# EAGLE design WavePainter_1.1 (EAGLE 9.5.1)
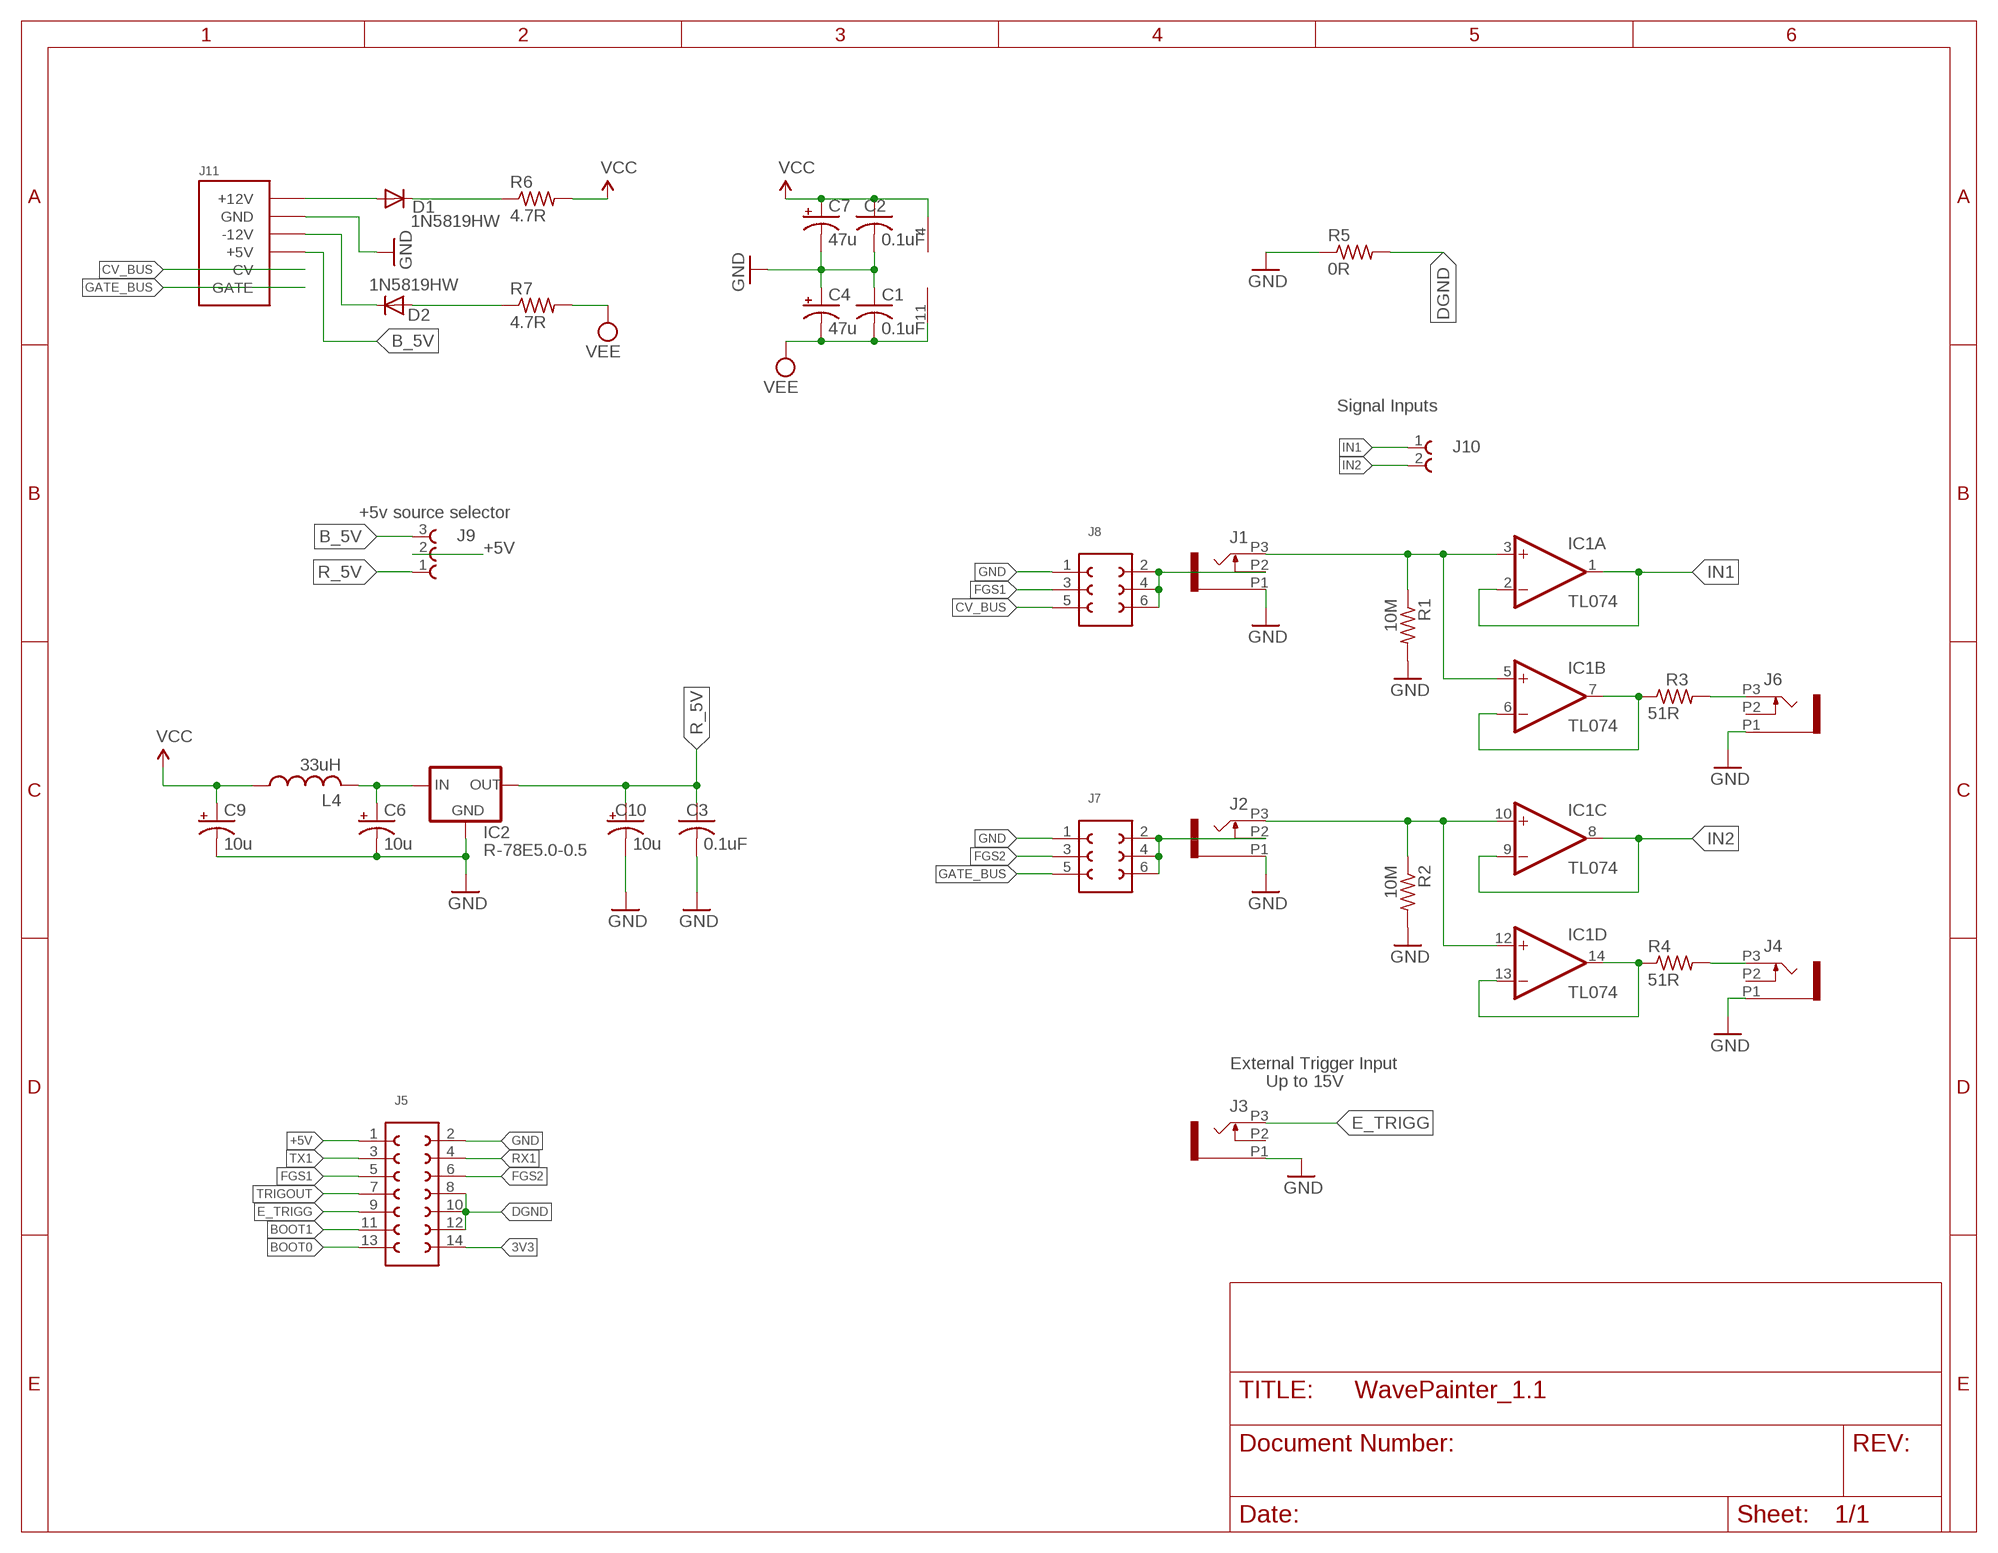
[diagram p0: schematic, sheet 1]

## Parts
C1  0.1uF  C-USC0805  [C0805]
C2  0.1uF  C-USC0805  [C0805]
C3  0.1uF  C-USC0805  [C0805]
C4  47u  CPOL-USD  [PANASONIC_D]
C6  10u  CPOL-USB  [PANASONIC_B]
C7  47u  CPOL-USD  [PANASONIC_D]
C9  10u  CPOL-USB  [PANASONIC_B]
C10  10u  CPOL-USB  [PANASONIC_B]
D1  1N5819HW  DIODE_DIODE-SOD123  [DIODE_SOD123]
D2  1N5819HW  DIODE_DIODE-SOD123  [DIODE_SOD123]
IC1  TL074  TL074D  [SO14]
IC2  R-78E5.0-0.5  [SIP3]
J1  OG-PJ301_PJ301_THONKICONN7  [OG-PJ301_WQP_PJ_301M7]
J2  OG-PJ301_PJ301_THONKICONN7  [OG-PJ301_WQP_PJ_301M7]
J3  OG-PJ301_PJ301_THONKICONN7  [OG-PJ301_WQP_PJ_301M7]
J4  OG-PJ301_PJ301_THONKICONN7  [OG-PJ301_WQP_PJ_301M7]
J5  62001421821  [62001421821]
J6  OG-PJ301_PJ301_THONKICONN7  [OG-PJ301_WQP_PJ_301M7]
J7  61300621121  [61300621121]
J8  61300621121  [61300621121]
J9  61300311121  [61300311121]
J10  61300211821  [61300211821]
J11  POWER_SHROUDED_NOTEXT  [POWER_16_SHROUDED_NOTEXT]
L4  33uH  L-USL3225P  [L3225P]
R1  10M  R-US_R0805  [R0805]
R2  10M  R-US_R0805  [R0805]
R3  51R  R-US_R0805  [R0805]
R4  51R  R-US_R0805  [R0805]
R5  0R  R-US_R0805  [R0805]
R6  4.7R  R-US_R1206  [R1206]
R7  4.7R  R-US_R1206  [R1206]

## Nets
3V3: J5.14
+5V: J5.1 J9.2
B_5V: J9.3 J11.11(+5V) J11.12(+5V)
BOOT0: J5.13
BOOT1: J5.11
CV_BUS: J8.5 J11.13(CV) J11.14(CV)
DGND: J5.8 J5.10 J5.12 R5.2
E_TRIGG: J3.P3 J5.9
FGS1: J5.5 J8.3
FGS2: J5.6 J7.3
GATE_BUS: J7.5 J11.15(GATE) J11.16(GATE)
GND: C1.1 C2.2 C3.2 C4.+ C6.- C7.- C9.- C10.- IC2.2(GND) J1.P1 J2.P1 J3.P1 J4.P1 J5.2 J6.P1 J7.1 J8.1 J11.3(GND) J11.4(GND) J11.5(GND) J11.6(GND) J11.7(GND) J11.8(GND) R1.2 R2.2 R5.1
IN1: IC1.1(A:OUT) IC1.2(A:-IN) J10.1
IN2: IC1.8(C:OUT) IC1.9(C:-IN) J10.2
N$1: IC1.10(C:+IN) IC1.12(D:+IN) J2.P3 R2.1
N$2: D2.C J11.1(-12V) J11.2(-12V)
N$3: C6.+ IC2.1(IN) L4.2
N$4: D1.A J11.9(+12V) J11.10(+12V)
N$5: IC1.3(A:+IN) IC1.5(B:+IN) J1.P3 R1.1
N$7: J4.P3 R4.2
N$8: D1.C R6.1
N$9: D2.A R7.1
N$10: J6.P3 R3.2
N$11: IC1.6(B:-IN) IC1.7(B:OUT) R3.1
N$12: IC1.13(D:-IN) IC1.14(D:OUT) R4.1
N$13: J1.P2 J8.2 J8.4 J8.6
N$14: J2.P2 J7.2 J7.4 J7.6
R_5V: C3.1 C10.+ IC2.3(OUT) J9.1
RX1: J5.4
TRIGOUT: J5.7
TX1: J5.3
VCC: C2.1 C7.+ C9.+ IC1.4(P:V+) L4.1 R6.2
VEE: C1.2 C4.- IC1.11(P:V-) R7.2
Unconnected: J3.P2 J4.P2 J6.P2

## Notes on the sheet
- Signal Inputs
- +5v source selector
- External Trigger Input
- Up to 15V

## Library data of the parts
C1-C3 = rcl:C-US: CAPACITOR, American symbol; SPICEPREFIX: C
C4 C7 = rcl:CPOL-US: POLARIZED CAPACITOR, American symbol
C6 C9 C10 = rcl:CPOL-US: POLARIZED CAPACITOR, American symbol; SPICEPREFIX: C
D1 D2 = elements_v02:DIODE_DIODE-: DIODE
IC1 = linear:TL074: OP AMP
IC2 = r-78xx_10:R-78E*-0.5: Innoline R-78xx-0.5 Series Switching Regulators - 0.5A, Low Cost Source: http://www.recom-international.com/pdf/Innoline/R-78Exx-0.5.pdf; MF: Recom; MPN: R-785.0-0.5; OC_FARNELL: 2078564; OC_NEWARK: 62X9499
J1-J4 J6 = elements_v02:OG-PJ301_PJ301_THONKICONN
J5 = Wurth_Elektronik_Electromechanic_Board_to_Board_Connectors_rev18b:62001421821: WR-PHD 2.00mm Dual Socket Header, 14 Pins=>Code : Con_BTB_SHD_2.00_2_62001421821 <http://katalog.we-online.de/media/thumbs2/eican/thb_Con_BTB_SHD_2.00_2_6200xx21821_pf2.jpg> Details see: http://katalog.we-online.de/en/em/PHD_2_00_DUAL_SOCKET_HEADER_6200XX21821 Created 2014-06-03, Karrer Zheng 2014 (C) Würth Elektronik
J7 J8 = Wurth_Elektronik_Electromechanic_Board_to_Board_Connectors_rev18b:61300621121: WR-PHD 2.54mm Dual Pin Header, 6 Pins =>Code : Con_BTB_PHD_2.54_2_61300621121 <http://katalog.we-online.de/media/images/eican/Con_BTB_PHD_2.54_2_6130xx21121_pf2.jpg> Details see: http://katalog.we-online.de/en/em/613_0xx_211_21 Created 2014-05-29, Karrer Zheng 2014 (C) Würth Elektronik
J9 = Wurth_Elektronik_Electromechanic_Board_to_Board_Connectors_rev17a:61300311121: WR-PHD 5.54mm Pin Header, 3 Pin =>Code : Con_BTB_PHD_2.54_1_THT_61300311121 <http://katalog.we-online.de/media/images/eican/Con_BTB_PHD_2.54_1_THT_6130xx11121_pf2.jpg> Details see: http://katalog.we-online.de/en/em/613_0xx_111_21 Created 2014-05-29, Karrer Zheng 2014 (C) Würth Elektronik
J10 = Wurth_Elektronik_Electromechanic_Board_to_Board_Connectors_rev17a:61300211821: WR-PHD 2.54mm Socket Header, 2 Pins =>Code : Con_BTB_SHD_2.54_1_THT_61300211821 <http://katalog.we-online.de/media/images/eican/Con_BTB_SHD_2.54_1_THT_6130xx11821_pf2.jpg> Details see: http://katalog.we-online.de/en/em/613_0xx_118_21 Created 2014-05-29, Karrer Zheng 2014 (C) Würth Elektronik
J11 = EurorackModularParts:POWER
L4 = rcl:L-US: INDUCTOR, American symbol; SPICEPREFIX: L
R1-R7 = rcl:R-US_: RESISTOR, American symbol; SPICEPREFIX: R

## Board
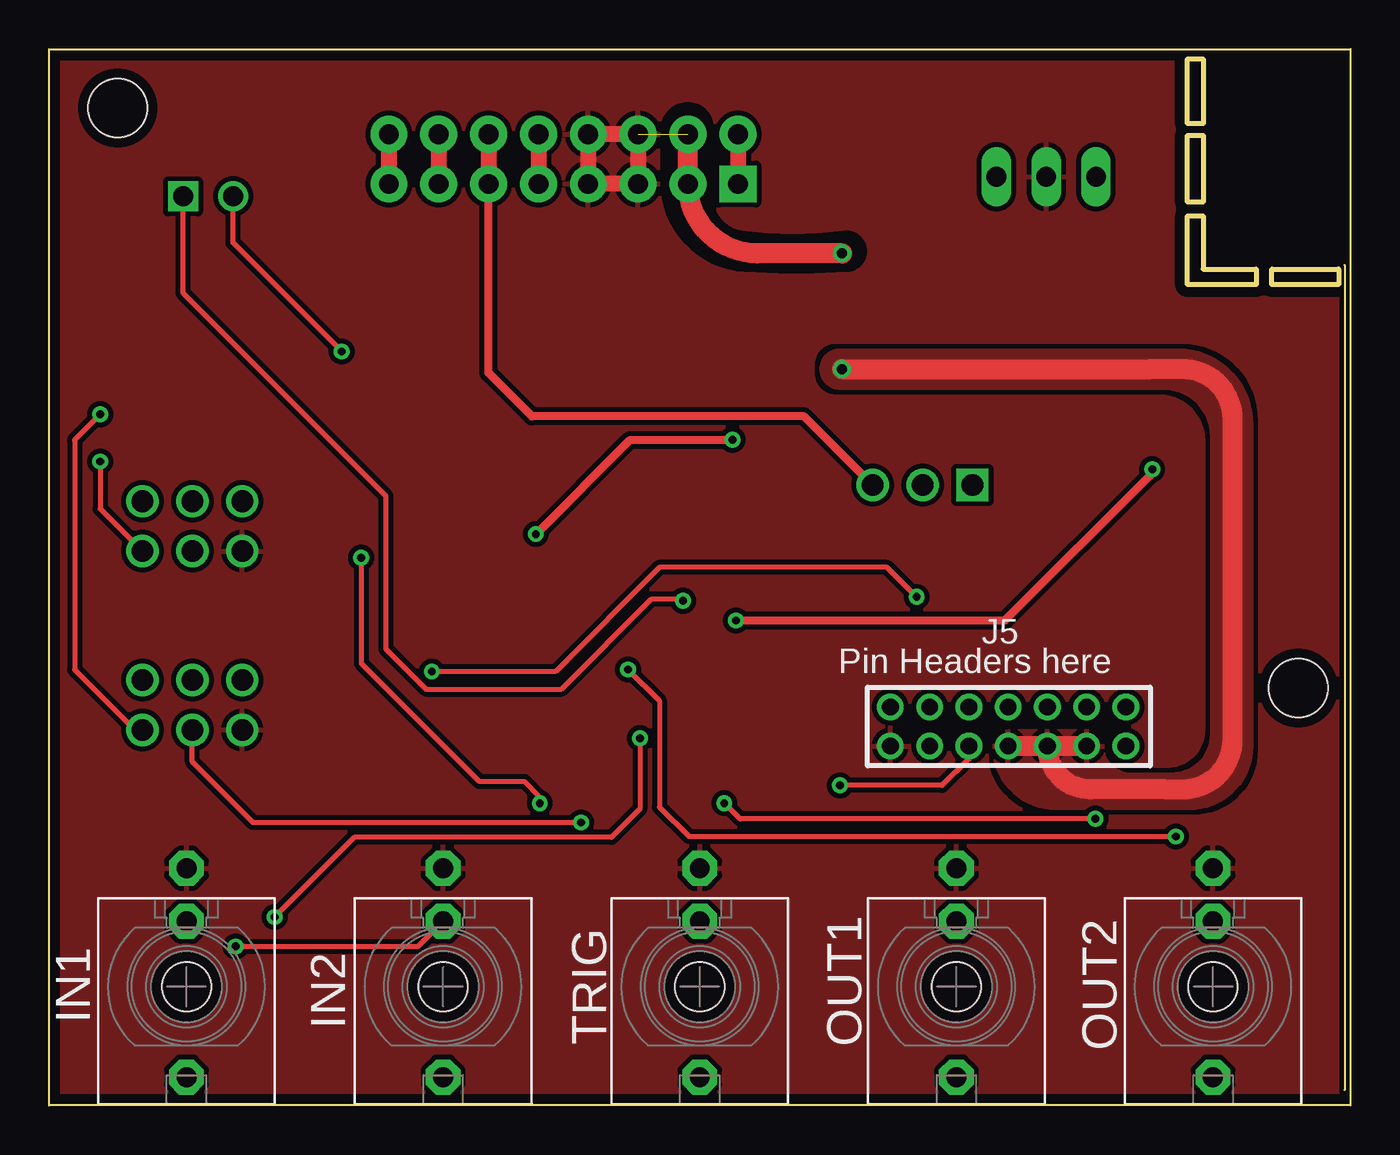
[diagram p1: board, top side]
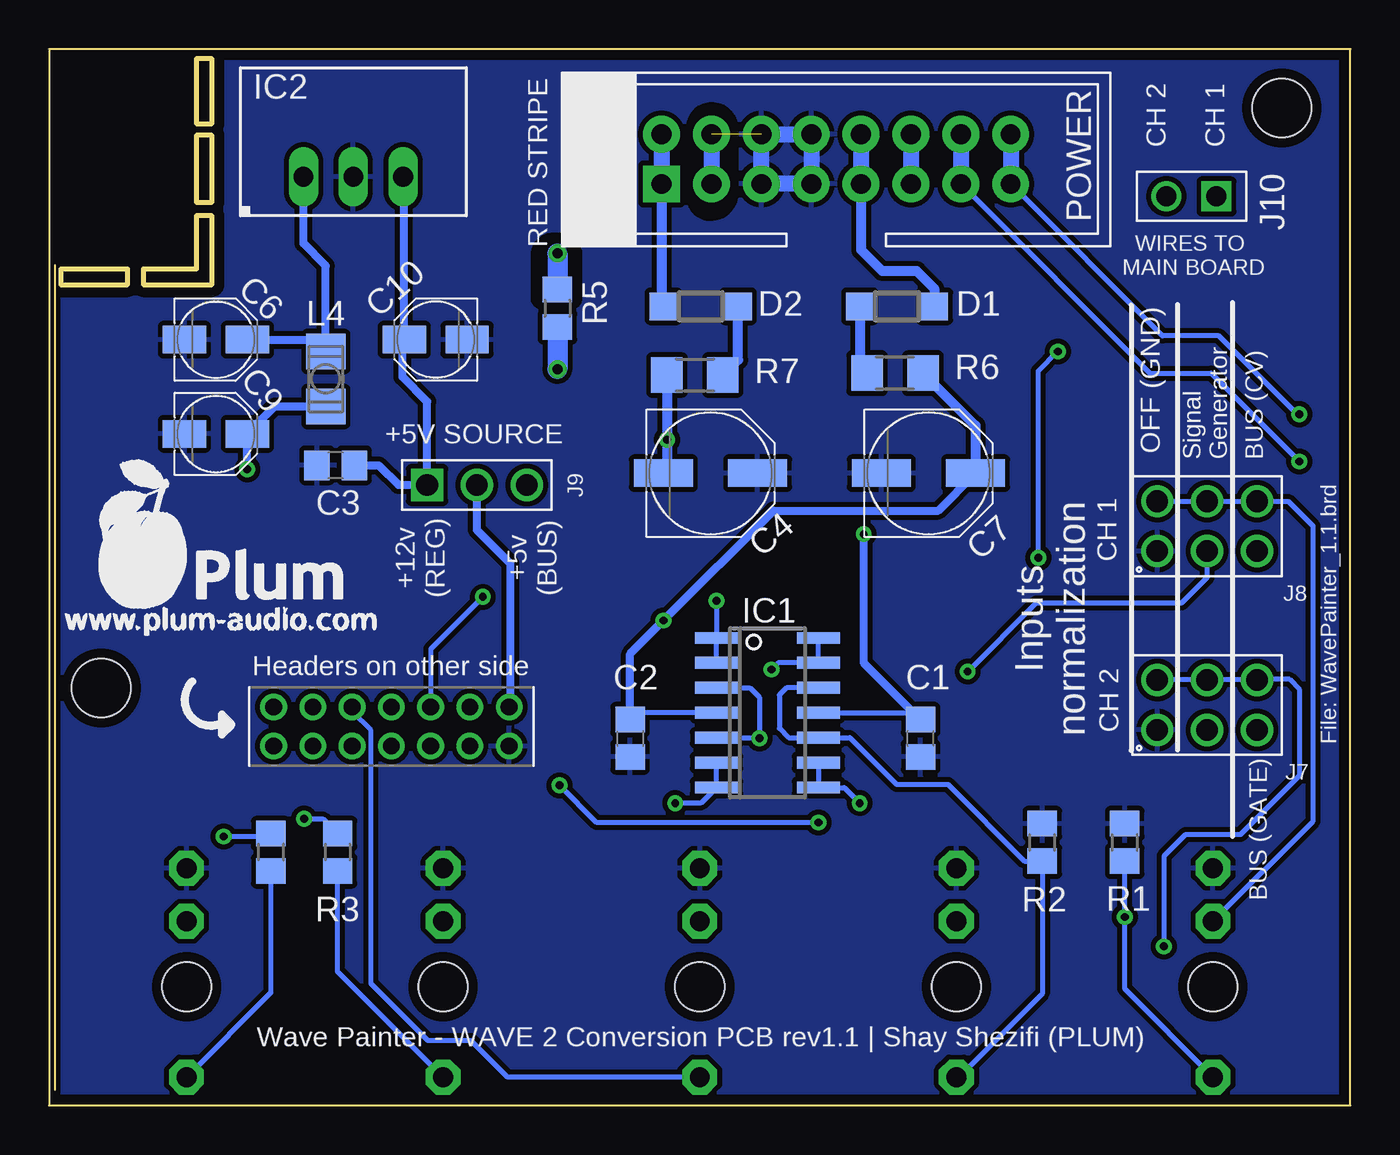
[diagram p2: board, bottom side, seen from below]

Size 66.3 x 53.8 mm. Coordinates in mm from the lower left corner, seen from the top.
Outline: 0,0 0,53.8 66.3,53.8 66.3,0 0,0
Outline: 58.8,53.3 58.8,50 58,50 58,53.3 58.8,53.3
Outline: 58.8,49.4 58.8,46 58,46 58,49.4 58.8,49.4
Outline: 58.8,45.3 58.8,42.6 61.5,42.6 61.5,41.8 58,41.8 58,45.3 58.8,45.3
Outline: 62.3,42.6 65.7,42.6 65.7,41.8 62.3,41.8 62.3,42.6
Copper layers (1*16): Top 0.035mm / dielectric 1.5mm / Bottom 0.035mm
Design rules "default *": minimum track width 10mil, minimum drill 0.4mm, track to track 10mil, track to pad 6mil, pad to pad 6mil, via to via 6mil, smd to smd 6mil, copper to edge 20mil, drill to drill 6mil, minimum pad ring 10mil, minimum via ring 8mil, stop-mask expansion 4mil, vias tented up to drill 25mil, thermal gap 10mil
Holes 3 mm at 3.5,50.8 63.64,21.26
Milling: 1 lines

### Footprints (pad centres in the part's own frame; a part is rotated, then mirrored left to right if it is on the bottom)
C0805 = smd 1.3 x 1.5: 1 -0.95,0; 2 0.95,0
PANASONIC_D = smd 3 x 1.4: + 2.4,0; - -2.4,0
PANASONIC_B = smd 2.2 x 1.4: + 1.6,0; - -1.6,0
DIODE_SOD123 = smd 1.4 x 1.4: A 1.9,0; C -1.9,0
SO14 = smd 0.6 x 2.2: 1 -3.81,-2.6; 2 -2.54,-2.6; 3 -1.27,-2.6; 4 0,-2.6; 5 1.27,-2.6; 6 2.54,-2.6; 7 3.81,-2.6; 8 3.81,2.6; 9 2.54,2.6; 10 1.27,2.6; 11 0,2.6; 12 -1.27,2.6; 13 -2.54,2.6; 14 -3.81,2.6
SIP3 = drill 1 long: 1 -2.54,0; 2 0,0; 3 2.54,0
OG-PJ301_WQP_PJ_301M7 = drill 1.016 pad 1.778 octagon: P1 0,-6.032; P2 0,-3.334; P3 0,4.604 | hole 2.5: 0,0
62001421821 = drill 0.85: 1 -6,-1; 2 -6,1; 3 -4,-1; 4 -4,1; 5 -2,-1; 6 -2,1; 7 0,-1; 8 0,1; 9 2,-1; 10 2,1; 11 4,-1; 12 4,1; 13 6,-1; 14 6,1
61300621121 = drill 1.1: 1 -2.54,-1.27; 2 -2.54,1.27; 3 0,-1.27; 4 0,1.27; 5 2.54,-1.27; 6 2.54,1.27
61300311121 = drill 1.1 square: 1 -2.54,0 | drill 1.1: 2 0,0; 3 2.54,0
61300211821 = drill 1.02 square: 1 -1.27,0 | drill 1.02: 2 1.27,0
POWER_16_SHROUDED_NOTEXT = drill 1.016 pad 1.88 square: 1 -8.89,-1.27 | drill 1.016 pad 1.88: 2 -8.89,1.27; 3 -6.35,-1.27; 4 -6.35,1.27; 5 -3.81,-1.27; 6 -3.81,1.27; 7 -1.27,-1.27; 8 -1.27,1.27; 9 1.27,-1.27; 10 1.27,1.27; 11 3.81,-1.27; 12 3.81,1.27; 13 6.35,-1.27; 14 6.35,1.27; 15 8.89,-1.27; 16 8.89,1.27
L3225P = smd 1.8 x 2: 1 -1.4,0; 2 1.4,0
R0805 = smd 1.3 x 1.5: 1 -0.95,0; 2 0.95,0
R1206 = smd 1.6 x 1.803: 1 -1.422,0; 2 1.422,0

### Placement (x,y rotation side)
C1  21.9,18.7 90 bottom
C2  36.7,18.7 270 bottom
C3  51.7,32.6 180 bottom
C4  32.6,32.2 0 bottom
C6  57.8,39 0 bottom
C7  21.5,32.2 0 bottom
C9  57.8,34.2 0 bottom
C10  46.6,39 180 bottom
D1  23.1,40.7 0 bottom
D2  33.1,40.7 0 bottom
IC1  29.7,20 270 bottom
IC2  50.8,47.3 0 bottom
J1  7,6.05 180 top
J2  20.07,6.05 180 top
J3  33.15,6.05 180 top
J4  59.3,6.05 180 top
J5  48.86,19.3 180 bottom
J6  46.23,6.05 180 top
J7  7.3,20.4 0 bottom
J8  7.3,29.5 0 bottom
J9  44.5,31.6 0 bottom
J10  8.1,46.3 180 bottom
J11  26.2,48.2 0 bottom
L4  52.2,37 90 bottom
R1  11.5,13.4 90 bottom
R2  15.7,13.4 90 bottom
R3  51.6,12.9 270 bottom
R4  55,12.9 270 bottom
R5  40.4,40.6 270 bottom
R6  23.2,37.3 0 bottom
R7  33.4,37.2 180 bottom

### Tracks (layer width: path | path; a pad name or v marks a point on that pad's centre or on a via)
+5V
  Bottom 0.406: J5.1 42.8,20.36 42.8,27.6 44.5,29.3 J9.2
B_5V
  Top 0.406: J9.3 38.46,35.1 24.6,35.1 22.39,37.31 J11.11
  Top 0.813: J11.12 J11.11
  Bottom 0.813: J11.12 J11.11
CUT
  cutout Bottom: 66.3,41.8 57.9,41.8 57.9,53.8 66.3,53.8
  cutout Top: 66.3,41.8 57.9,41.8 57.9,53.8 66.3,53.8
CV_BUS  (via drill 0.4)
  Top 0.254: J8.5 2.6,30.39 v2.6,32.8
  Top 0.813: J11.14 J11.13
  Bottom 0.254: J11.13 10.22,37.3 7.1,37.3 v2.6,32.8
  Bottom 0.813: J11.14 J11.13
DGND  (via drill 0.5)
  Top 0.61: 58.1,16.1 56.9,16.1
  Top 1.016: J5.12 J5.10 | J5.10 J5.8 | v40.4,37.5 56.1,37.5 57.76,37.5 arc-90 60.3,34.96 60.3,21.8 60.3,18.64 arc-90 57.76,16.1 56.9,16.1 53.06,16.1 arc-90 J5.10
  Bottom 1.016: R5.2 v40.4,37.5
  pour Top: 40.3,38.5 57.5,38.5 arc-90 61.3,34.7 61.3,18.3 arc-90 58.1,15.1 51.3,15.1 arc-90 48.1,18.3 arc-90 48.9,19.1 53.2,19.1 arc-90 53.7,18.6 53.7,18.3 arc90 55.1,16.9 57.2,16.9 arc90 59.2,18.9 59.2,34.1 arc90 56.8,36.5 40.3,36.5 arc-90 39.3,37.5 arc-90
E_TRIGG
  Bottom 0.254: J5.9 50.86,20.06 49.9,19.1 49.9,6.2 47,3.3 44.8,3.3 42.95,1.45 J3.P3
FGS1  (via drill 0.4)
  Top 0.254: v44.2,25.9 42.69,27.41 31.1,27.41 25.79,22.1 v19.5,22.1
  Bottom 0.254: v44.2,25.9 46.86,23.24 J5.5 | v19.5,22.1 16,25.6 8.6,25.6 7.3,26.9 J8.3
FGS2  (via drill 0.4)
  Top 0.254: J5.6 46.86,17.66 45.5,16.3 v40.3,16.3 | v27.1,14.41 10.39,14.41 7.3,17.5 J7.3
  Bottom 0.254: v27.1,14.41 38.41,14.41 v40.3,16.3
GATE_BUS  (via drill 0.4)
  Top 0.254: v2.6,35.2 1.3,33.9 1.3,22.2 4.37,19.13 J7.5
  Top 0.813: J11.16 J11.15
  Bottom 0.254: v2.6,35.2 2.7,35.2 6.7,39.2 9.58,39.2 J11.15
  Bottom 0.813: J11.16 J11.15
GND  (via drill 0.5)  (1 unrouted)
  Top 0.813: J11.6 J11.8 J11.7 J11.5 J11.6
  Top 1.016: v40.4,43.4 36.08,43.4 arc-90 J11.3 J11.4
  Bottom 0.813: J11.4 J11.3 | J11.6 J11.8 J11.7 J11.5 J11.6
  Bottom 1.016: v40.4,43.4 R5.1
  pour Bottom (rank 5): 66.3,53.8 0.17,53.8 0.17,0 66.3,0
  pour Top (rank 3): 66.3,53.8 0.17,53.8 0.17,0 66.3,0
  cutout Bottom: 40.2,44.4 40.6,44.4 arc-90 41.7,43.3 41.7,41.1 arc-90 41.2,40.6 39.7,40.6 arc-90 39.2,41.1 39.2,43.4 arc-90
IN1  (via drill 0.4)
  Top 0.254: v32.3,25.7 32.2,25.8 30.7,25.8 26.1,21.2 19.2,21.2 17.15,23.25 17.15,31.05 6.83,41.37 J10.1
  Bottom 0.254: IC1.2 IC1.1 v32.3,25.7
IN2  (via drill 0.4)
  Top 0.254: v14.9,38.4 9.37,43.93 J10.2 | v15.9,27.9 15.9,22.52 21.92,16.5 24.2,16.5 25,15.7 v25,15.4
  Bottom 0.254: IC1.9 IC1.8 25.79,16.19 v25,15.4 | v15.9,27.9 15.9,37.4 v14.9,38.4
N$1
  Bottom 0.254: IC1.12 28.73,21.27 29.09,20.91 29.09,19.2 28.62,18.73 IC1.10 25.5,18.73 23.12,16.35 20.5,16.35 16.6,12.45 R2.1 15.7,5.7 19.95,1.45 J2.P3
N$2
  Top 0.813: J11.2 J11.1
  Bottom 0.508: D2.C 35.09,40.79 J11.1
  Bottom 0.813: J11.2 J11.1
N$3
  Bottom 0.406: L4.2 52.3,38.5 | IC2.1 53.34,43.9 52.2,42.76 L4.2 | C6.+ 52.8,39 L4.2
N$4
  Top 0.813: J11.10 J11.9
  Bottom 0.508: J11.9 24.93,43.57 23.86,42.5 22.1,42.5 21.2,41.6 D1.A
  Bottom 0.813: J11.10 J11.9
N$5  (via drill 0.4)
  Top 0.254: v11.5,9.6 15.55,13.65 28.65,13.65 30.1,15.1 v30.1,18.7
  Bottom 0.254: IC1.3 30.6,21.27 30.11,20.78 v30.11,18.71 | J1.P3 11.5,5.95 v11.5,9.6 R1.1 | v30.11,18.71 v30.1,18.7 | IC1.5 30.13,18.73 v30.11,18.71
N$7
  Bottom 0.254: R4.2 55,5.75 J4.P3
N$8
  Bottom 0.508: D1.C 25,37.68 R6.1
N$9
  Bottom 0.508: R7.1 31.2,37.98 D2.A
N$10
  Bottom 0.254: J6.P3 51.6,6.82 R3.2
N$11  (via drill 0.4)
  Top 0.254: v53.3,14.6 35.2,14.6 v34.4,15.4
  Bottom 0.254: IC1.6 IC1.7 33.09,15.4 v34.4,15.4 | v53.3,14.6 52.35,14.6 R3.1
N$12  (via drill 0.4)
  Top 0.254: v29.5,22.2 31.1,20.6 31.1,15.2 32.6,13.7 v57.4,13.7
  Bottom 0.254: IC1.14 IC1.13 29.16,22.54 v29.5,22.2 | v57.4,13.7 55.15,13.7 R4.1
N$13
  Bottom 0.254: J1.P2 1.9,14.48 1.9,29.5 3.17,30.77 J8.6 J8.4 J8.2
N$14  (via drill 0.4)
  Top 0.254: J2.P2 18.79,8.1 v9.5,8.1
  Bottom 0.254: v9.5,8.1 9.5,12.7 8.4,13.8 5.6,13.8 2.61,16.79 2.61,21.21 3.1,21.7 4.73,21.7 J7.6 J7.4 J7.2
R_5V
  Bottom 0.406: C3.1 49.5,32.6 48.5,31.6 J9.1 47.04,35.84 48.3,37.1 48.3,38.9 C10.+ 48.2,47.24 IC2.3
VCC  (via drill 0.4)
  Top 0.406: v35,24.7 48.7,24.7 56.2,32.2 v56.2,32.4
  Bottom 0.254: IC1.4 36.35,20 C2.1
  Bottom 0.406: C2.1 36.7,23 v35,24.7 29.4,30.3 21,30.3 C7.+ | v56.2,32.4 C9.+ 54.8,35.6 L4.1
  Bottom 0.508: R6.2 19.1,34.62 C7.+
VEE  (via drill 0.4)
  Top 0.406: v24.8,29.1 29.6,33.9 v34.82,33.9
  Bottom 0.254: IC1.11 22.25,20 C1.2
  Bottom 0.406: v24.8,29.1 24.8,22.55 C1.2
  Bottom 0.508: R7.2 v34.82,33.9 34.82,32.38 C4.-
ZERO
  cutout Top (rank 3): 32.55,51.05 arc90 31.2,49.7 31.2,47.05 arc86 35.46,42.5 arc7 40.67,42.5 arc184 40.47,44.5 arc-15 35.3,44.5 arc-86 33.8,46.35 33.8,49.8 arc90
  cutout Bottom (isolate 0.254, rank 3): 32.55,51.05 arc-90 33.8,49.8 33.8,46.3 arc-90 32.6,45.1 arc-90 31.2,46.5 31.2,49.7 arc-90

### Text on the board
tPlace: J5 | Pin Headers here | IN1 | IN2 | TRIG | OUT1 | OUT2
bPlace: CH 1 | CH 2 | POWER | RED STRIPE | WIRES TO / MAIN BOARD | +5V SOURCE | BUS (CV) | Signal / Generator | OFF (GND) | CH 1 | +5v / (BUS) | +12v / (REG) | Inputs / normalization | Headers on other side | File: WavePainter_1.1.brd | CH 2 | BUS (GATE) | Wave Painter - WAVE 2 Conversion PCB rev1.1 | Shay Shezifi (PLUM)